# Altium project InsulationMonitor.PrjPcb
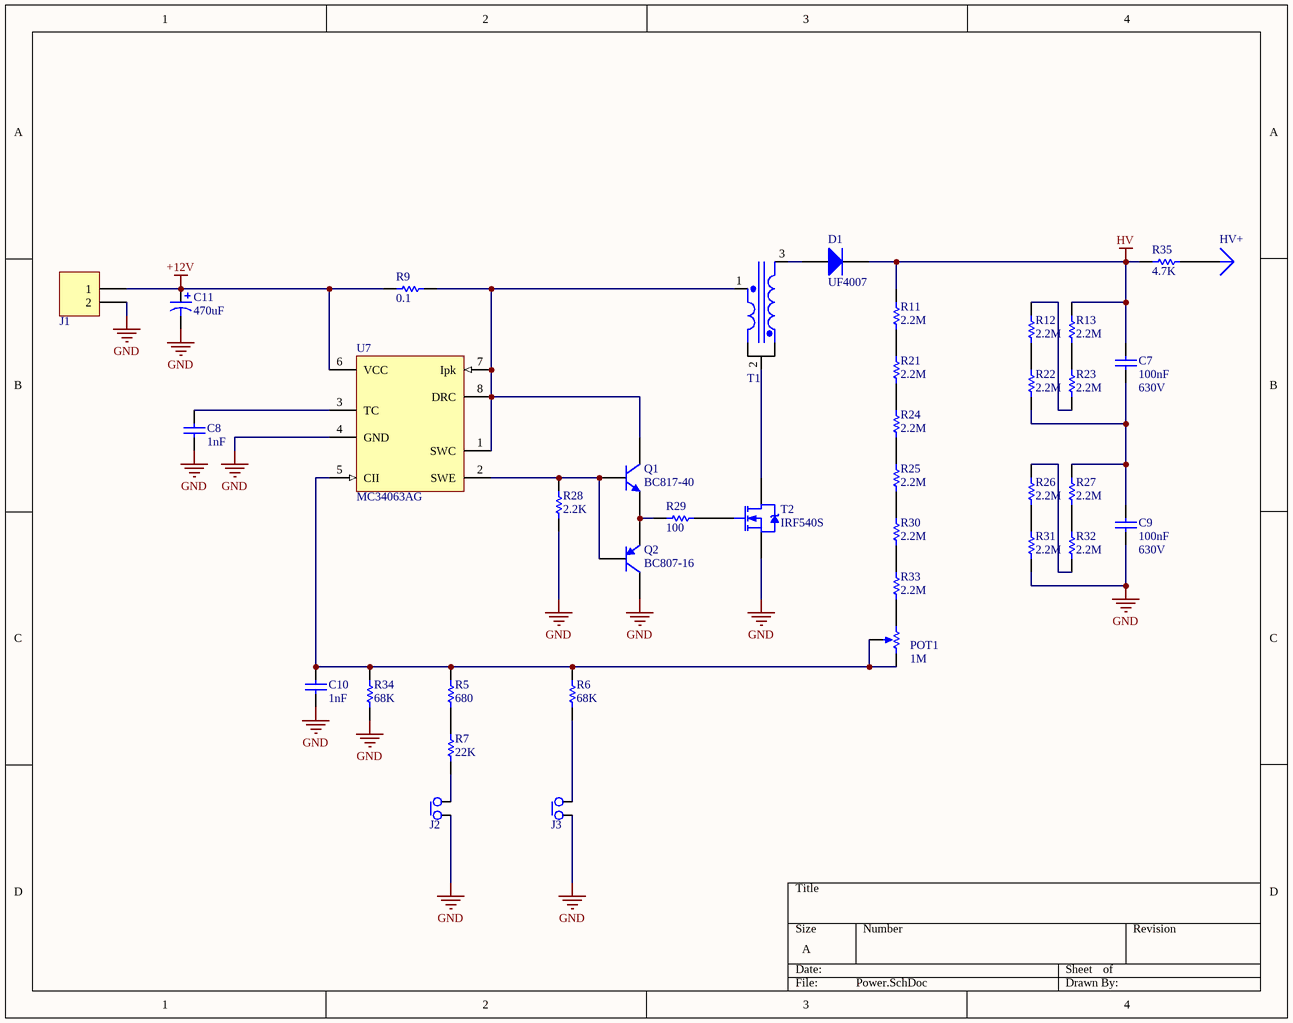
[diagram p0: Power.SchDoc]
1 sheet, 38 parts. Net scope: global (net labels, ports and power ports of the same name join across sheets).
Board file: Monitor.PcbDoc

## Sheet Power.SchDoc
size A

### Parts
C7  100nF  [CAP-POLY-15]
C8  1nF  [C805]
C9  100nF  [CAP-POLY-15]
C10  1nF  [C805]
C11  470uF  [CAP-SMD-6]
D1  UF4007  [DO-214AA]
HV+  Plug  [PIN1]  (value not drawn)
J1  CONN-2  [XH-2]  (value not drawn)
J2  jumper  [Selector]  (value not drawn)
J3  jumper  [Selector]  (value not drawn)
POT1  Resistance: 1M  [Multi Turn V]  (hidden comment: POT)
Q1  BC817-40  [SOT-23]
Q2  BC807-16  [SOT-23]
R5  680  [R805]
R6  68K  [R805]
R7  22K  [R805]
R9  0.1  [RES-5w]
R11  2.2M  [R1206]
R12  2.2M  [R1206]
R13  2.2M  [R1206]
R21  2.2M  [R1206]
R22  2.2M  [R1206]
R23  2.2M  [R1206]
R24  2.2M  [R1206]
R25  2.2M  [R1206]
R26  2.2M  [R1206]
R27  2.2M  [R1206]
R28  2.2K  [R805]
R29  100  [R805]
R30  2.2M  [R1206]
R31  2.2M  [R1206]
R32  2.2M  [R1206]
R33  2.2M  [R1206]
R34  68K  [R1206]
R35  4.7K  [R1206]
T1  Transformer 2-1  [trans-26]  (value not drawn)
T2  IRF540S  [D2PAK-2]
U7  MC34063AG  [SOP-8]

### Nets
+12V: C11.1 J1.1 R9.1 U7.6(VCC)
GND: C8.1 C9.1 C10.1 C11.2 J1.2 J2.1(C1) J3.1(C1) Q2.3(C) R28.1 R31.2 R34.2 T2.3(S) U7.4(GND)
HV: C7.2 D1.2(K) R11.1 R13.1 R35.1
NetC7_1: C7.1 C9.2 R22.2 R27.1
NetC8_2: C8.2 U7.3(TC)
NetC10_2: C10.2 POT1.2(BOT) POT1.3(TAP) R5.1 R6.1 R34.1 U7.5(CII)
NetD1_1: D1.1(A) T1.3(S)
NetHV+_1: HV+.1 R35.2
NetJ2_2: J2.2(C2) R7.1
NetJ3_2: J3.2(C2) R6.2
NetPOT1_1: POT1.1(TOP) R33.2
NetQ1_1: Q1.1(B) Q2.1(B) R28.2 U7.2(SWE)
NetQ1_2: Q1.2(E) Q2.2(E) R29.2
NetQ1_3: Q1.3(C) R9.2 T1.1(S) U7.1(SWC) U7.7(Ipk) U7.8(DRC)
NetR5_2: R5.2 R7.2
NetR11_2: R11.2 R21.1
NetR12_1: R12.1 R23.2
NetR12_2: R12.2 R22.1
NetR13_2: R13.2 R23.1
NetR21_2: R21.2 R24.1
NetR24_2: R24.2 R25.1
NetR25_2: R25.2 R30.1
NetR26_1: R26.1 R32.2
NetR26_2: R26.2 R31.1
NetR27_2: R27.2 R32.1
NetR29_1: R29.1 T2.1(G)
NetR30_2: R30.2 R33.1
NetT1_2: T1.2(F) T2.4(D)

### Notes on the sheet
- (in symbol Cap) 630V

### Library data of the parts
C7-C10 = Cap: Capacitor; Designer: Parsa Malekpour
  C7 C9: Value: 100nF
  C8 C10: Value: 1nF
C11 = CAP-POL: Polar Capacitor; Voltage: 10V; Value: 470uF
D1 = Diode 1N4007: 1 Amp General Purpose Rectifier; Published: 8-Jun-2000; LatestRevisionDate: 17-Jul-2002; LatestRevisionNote: Re-released for DXP Platform.; DatasheetVersion: 1998; PackageVersion: Aug-1999; PackageReference: DO-41; Publisher: Altium Limited; PackageDescription: Diode, Axial; Body 5.2 x 2.7 mm (LxDia. max), Lead Dia. 0.86 mm (max); Code_JEDEC: DO-204-AL; ComponentLink1Description: Manufacturer Link; ComponentLink1URL: http://www.fairchildsemi.com/; ComponentLink2Description: Datasheet; ComponentLink2URL: http://www.fairchildsemi.com/ds/1N%2F1N4001.pdf
J2 J3 = Jumper Select: Jumper wire
POT1 = R-POT: Varible Resistor
Q1 = BC817-40: NPN General Purpose Amplifier; Published: 8-Jun-2000; LatestRevisionDate: 20-Nov-2009; LatestRevisionNote: IPC-7351 Footprint Added.; DatasheetVersion: 1997; PackageVersion: Sep-1998; PackageReference: SOT-23A; Publisher: Altium Limited; PackageDescription: 3-Pin SOT-23 Package 0.95 mm Pitch, 2.3 mm Lead Span; ComponentLink1Description: Manufacturer Link; ComponentLink1URL: http://www.fairchildsemi.com/; ComponentLink2Description: Discontinuation Notice; ComponentLink2URL: http://www.fairchildsemi.com/obsolete/obs.jsp
Q2 = BC807-16: PNP General Purpose Amplifier; Published: 8-Jun-2000; LatestRevisionDate: 20-Nov-2009; LatestRevisionNote: IPC-7351 Footprint Added.; DatasheetVersion: 1997; PackageVersion: Sep-1998; PackageReference: SOT-23A; Publisher: Altium Limited; PackageDescription: 3-Pin SOT-23 Package 0.95 mm Pitch, 2.3 mm Lead Span; ComponentLink1Description: Manufacturer Link; ComponentLink1URL: http://www.fairchildsemi.com/; ComponentLink2Description: Datasheet; ComponentLink2URL: http://www.fairchildsemi.com/ds/BC%2FBC807.pdf
R5-R7 R9 R11-R13 R21-R35 = Resistor: Designer: Parsa Malekpour
  R5: Value: 680
  R6 R34: Value: 68K
  R7: Value: 22K
  R9: Value: 0.1
  R11-R13 R21-R27 R30-R33: Value: 2.2M
  R28: Value: 2.2K
  R29: Value: 100
  R35: Value: 4.7K
T1 = TRSNS 2-1: Three-winding Transformer
T2 = IRF540: N-Channel MOSFET
HV+ = Plug: LatestRevisionDate: 17-Jul-2002; LatestRevisionNote: Re-released for DXP Platform.; Publisher: Altium Limited